# Altium project Demo.PrjPcb (part 2 of 2)

## Sheet Display_Memory.SchDoc
size A4; SheetNumber: 4; SheetTotal: 4
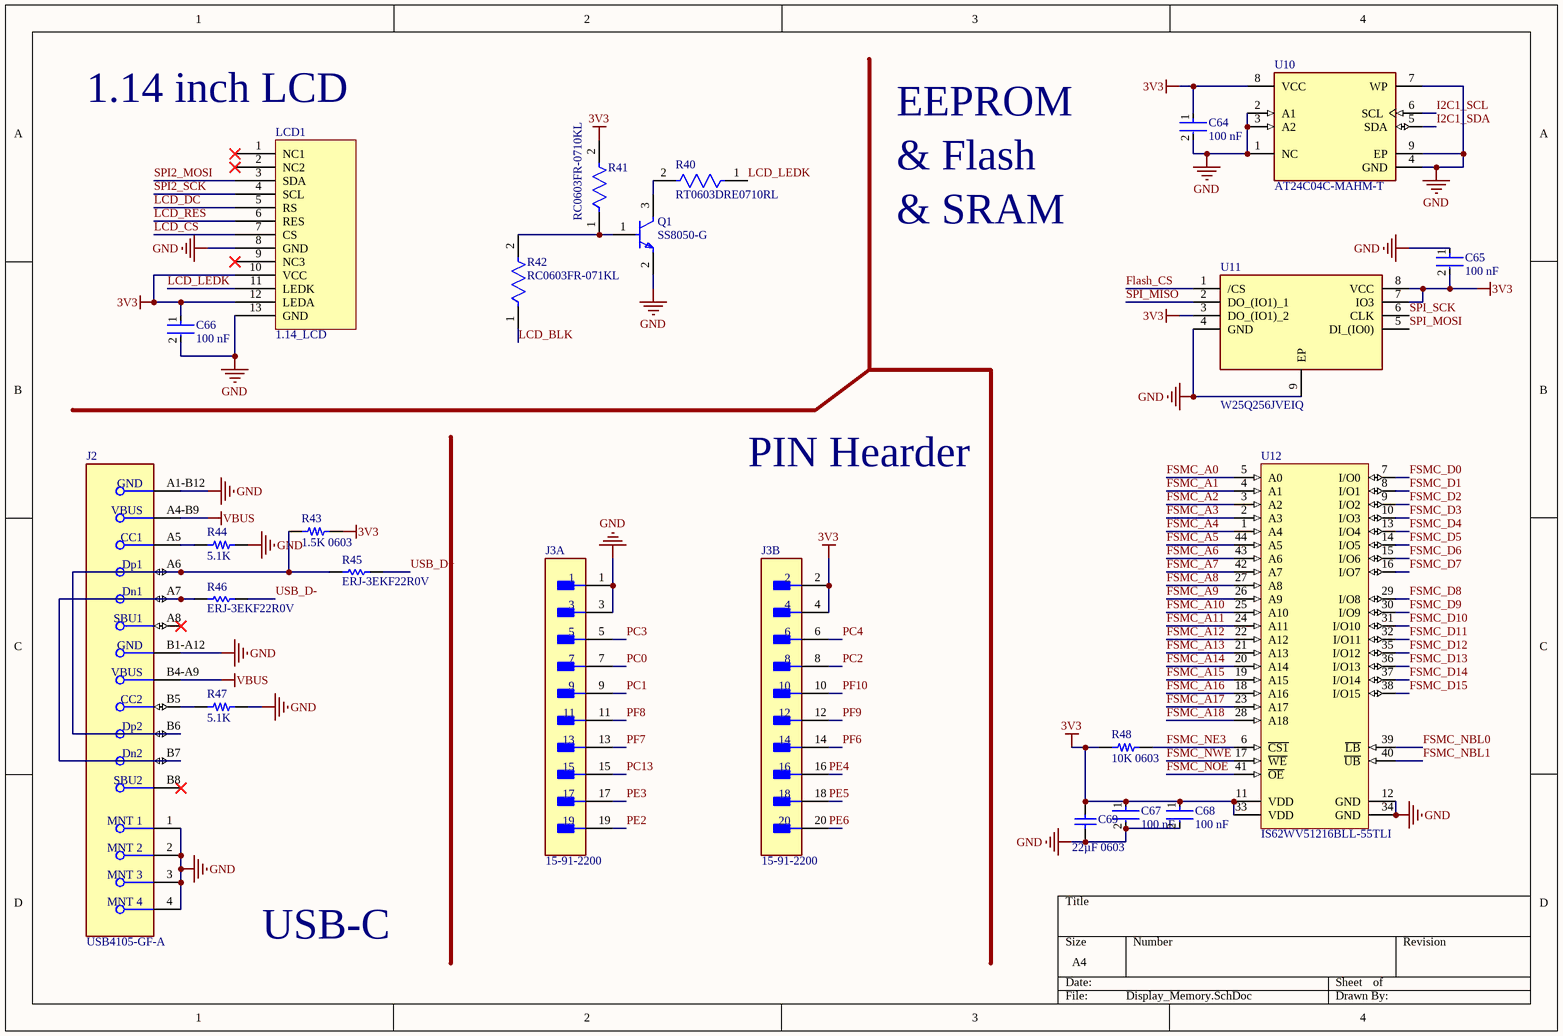
[diagram p3: Display_Memory.SchDoc]

### Parts
C64  100 nF  [FP-CL10-IPC_A]
C65  100 nF  [FP-CL10-IPC_A]
C66  100 nF  [FP-CL10-IPC_A]
C67  100 nF  [FP-CL10-IPC_A]
C68  100 nF  [FP-CL10-IPC_A]
C69  22µF 0603  [CAPC1608X100X20ML10]
J2  USB4105-GF-A  [FP-USB4105-GF-A-MFG]
J3  15-91-2200  [FP-15-91-2200-MFG]  (parts A,B of 2)
LCD1  1.14_LCD  [1.14_LCD]
Q1  SS8050-G  [FP-SS8050-G-MFG]
R40  RT0603DRE0710RL  [FP-RT0603-MFG]
R41  RC0603FR-0710KL  [FP-RC0603-0_55-IPC_C]
R42  RC0603FR-071KL  [FP-RC0603-0_55-IPC_C]
R43  1.5K 0603  [5.1K_0603]
R44  5.1K  [5.1K_0603]
R45  ERJ-3EKF22R0V  [RESC1608X55X30LL15T15]
R46  ERJ-3EKF22R0V  [RESC1608X55X30LL15T15]
R47  5.1K  [5.1K_0603]
R48  10K 0603  [5.1K_0603]
U10  AT24C04C-MAHM-T  [FP-C04-21355-Q4B-IPC_B]
U11  W25Q256JVEIQ  [W25Q256JVEIQ]
U12  IS62WV51216BLL-55TLI  [ISSI-TSOP-2-44_N]

### Nets
3V3: C64.1 C65.2 C66.1 C67.1 C68.1 C69.2 J3.2 J3.4 LCD1.10(VCC) LCD1.12(LEDA) R41.2 R43.2 R48.1 U10.8(VCC) U11.3(DO_(IO1)_2) U11.7(IO3) U11.8(VCC) U12.11(VDD) U12.33(VDD)
GND: C64.2 C65.1 C66.2 C67.2 C68.2 C69.1 J2.1(MNT_1) J2.2(MNT_2) J2.3(MNT_3) J2.4(MNT_4) J2.A1-B12(GND) J2.B1-A12(GND) J3.1 J3.3 LCD1.8(GND) LCD1.13(GND) Q1.2(E) R44.2 R47.2 U10.1(NC) U10.2(A1) U10.3(A2) U10.4(GND) U10.7(WP) U10.9(EP) U11.4(GND) U11.9(EP) U12.12(GND) U12.34(GND)
VBUS: J2.A4-B9(VBUS) J2.B4-A9(VBUS)
Flash_CS: U11.1(/CS)
FSMC_A0: U12.5(A0)
FSMC_A1: U12.4(A1)
FSMC_A2: U12.3(A2)
FSMC_A3: U12.2(A3)
FSMC_A4: U12.1(A4)
FSMC_A5: U12.44(A5)
FSMC_A6: U12.43(A6)
FSMC_A7: U12.42(A7)
FSMC_A8: U12.27(A8)
FSMC_A9: U12.26(A9)
FSMC_A10: U12.25(A10)
FSMC_A11: U12.24(A11)
FSMC_A12: U12.22(A12)
FSMC_A13: U12.21(A13)
FSMC_A14: U12.20(A14)
FSMC_A15: U12.19(A15)
FSMC_A16: U12.18(A16)
FSMC_A17: U12.23(A17)
FSMC_A18: U12.28(A18)
FSMC_D0: U12.7(I/O0)
FSMC_D1: U12.8(I/O1)
FSMC_D2: U12.9(I/O2)
FSMC_D3: U12.10(I/O3)
FSMC_D4: U12.13(I/O4)
FSMC_D5: U12.14(I/O5)
FSMC_D6: U12.15(I/O6)
FSMC_D7: U12.16(I/O7)
FSMC_D8: U12.29(I/O8)
FSMC_D9: U12.30(I/O9)
FSMC_D10: U12.31(I/O10)
FSMC_D11: U12.32(I/O11)
FSMC_D12: U12.35(I/O12)
FSMC_D13: U12.36(I/O13)
FSMC_D14: U12.37(I/O14)
FSMC_D15: U12.38(I/O15)
FSMC_NBL0: U12.39(~{LB})
FSMC_NBL1: U12.40(~{UB})
FSMC_NE3: R48.2 U12.6(~{CS1})
FSMC_NOE: U12.41(~{OE})
FSMC_NWE: U12.17(~{WE})
I2C1_SCL: U10.6(SCL)
I2C1_SDA: U10.5(SDA)
LCD_BLK: R42.1
LCD_CS: LCD1.7(CS)
LCD_DC: LCD1.5(RS)
LCD_LEDK: LCD1.11(LEDK) R40.1
LCD_RES: LCD1.6(RES)
PC0: J3.7
PC1: J3.9
PC2: J3.8
PC3: J3.5
PC4: J3.6
PC13: J3.15
PE2: J3.19
PE3: J3.17
PE4: J3.16
PE5: J3.18
PE6: J3.20
PF6: J3.14
PF7: J3.13
PF8: J3.11
PF9: J3.12
PF10: J3.10
SPI2_MOSI: LCD1.3(SDA)
SPI2_SCK: LCD1.4(SCL)
SPI_MISO: U11.2(DO_(IO1)_1)
SPI_MOSI: U11.5(DI_(IO0))
SPI_SCK: U11.6(CLK)
USB_D+: R45.2
USB_D-: R46.2
NetJ2_A5: J2.A5(CC1) R44.1
NetJ2_A6: J2.A6(Dp1) J2.B6(Dp2) R43.1 R45.1
NetJ2_A7: J2.A7(Dn1) J2.B7(Dn2) R46.1
NetJ2_B5: J2.B5(CC2) R47.1
NetQ1_1: Q1.1(B) R41.1 R42.2
NetQ1_3: Q1.3(C) R40.2

Not connected (* = marked no-connect by the designer): J2 A8(SBU1)* B8(SBU2)*; LCD1 1(NC1)* 2(NC2)* 9(NC3)*

### Notes on the sheet
- (near LCD1) 1.14 inch LCD
- EEPROM
- & Flash
- & SRAM
- PIN Hearder
- USB-C

### Library data of the parts
C64-C68 = CMP-13271-004036-1: Cap Ceramic 100nF 100V X7R ±10% Pad SMD 0603 +125°C T/R; Mount: Surface Mount; Packaging: Cut Tape; Width: 0.031inch; Thickness: 0.035inch; Length: 0.063inch; Tolerance: 10%; Min Operating Temperature: -55°C; Case/Package: 0603; Voltage Rating: 100V; Max Operating Temperature: 125°C; Case Code (Metric): 1608; Capacitance: 100nF; Case Code (Imperial): 0603
C69 = CMP-2000-05440-1: Chip Capacitor, 22 uF, +/- 20%, 6.3 V, -55 to 85 degC, 1608 (0603 Metric), RoHS, Tape and Reel; PCN Part Number: MLCCPartNumberChange30/Nov/2012; Manufacturer: TDK; Temperature Coefficient: X5R; Product Training Modules: CSeriesGeneralApplicationsSEAT,CCV,andTVCLDesignToolsGuidetoReplacinganElectrolyticCapacitorwithanMLCC; Other Names: 445-8028-1; Voltage - Rated: 6.3V; Design Resources: 20WNon-IsolatedBuckLEDDriverUsingPLLNK460KG; Online Catalog: CSeries,GeneralPurpose; Kits: 445-9003-KIT-ND-KITCAPCERHICAPMLCCSMD; Tolerance: ±20%; Series: C; Thickness (Max): 0.039"(1.00mm); Capacitance: 22µF; Mounting Type: SurfaceMount,MLCC; Ratings: -; Datasheet Version: Mar-15; Package Reference: 603; Packaging: CutTape(CT); Features: -; Package / Case: 0603(1608Metric); Family: CeramicCapacitors; Lead Spacing: -; RoHS Information: RoHSCertificate-MLCC; Manufacturer URL: http://www.tdk.com/; Lead Style: -; Category: Capacitors; Applications: GeneralPurpose; Package Description: 2-Pin Surface Mount Device, Body 1.6 x 0.8 mm; Standard Package: 1; Datasheet URL: http://www.farnell.com/datasheets/1913358.pdf; Height - Seated (Max): -; Operating Temperature: -55degC~85degC; Size / Dimension: 0.063"Lx0.031"W(1.60mmx0.80mm)
J2 = CMP-245163-000001-1: CONN RCPT USB2.0 TYPEC 5A; Manufacturer: GCT; Voltage Rating: 20V; Is Female: yes; Current Rating: 5/6.25/1.25/0.25A; Number Of Contacts: 16; Conn Orientation: Right Angle; Device Class L1: Connectors; Category: Conn; Lead Free: Yes; RoHS: TRUE; Temperature Range High: +85°C; Digikey Description: CONN RCPT USB2.0 TYPEC 5A; Device Class L3: unset; ComponentLink2Description: Datasheet; Manufacturer Part Number: USB4105-GF-A; Package: 0; Usb Standard: USB 2.0; Device Class L2: USB Connectors; Automotive: No; Temperature Range Low: -40°C; Height: 3.46mm; Temperature: -40°C to +85°C; Contact Material: Gold,Nickel; ComponentLink2URL: https://gct.co/files/drawings/usb4105.pdf; Octopart: https://octopart.com/usb4105-gf-a-gct-106627878
J3 = CMP-00257-00276808-1: 15-91-2200 Conn Unshrouded Header HDR 20 POS 2.54mm Solder ST Top Entry SMD C-Grid® Tube; NexarPartId: 276808; Number of Circuits: 20; Voltage Rating (DC): 250V; Max Voltage Rating (DC): 250.25kV; Glow Wire Compliant: Non-compliant; Gender: Male; Contact Resistance: 15mΩ; Current Rating: 3A; Contact Gender: Male; Min Operating Temperature: -40°C; Pitch: 2.54mm; Number of Rows: 1; Number of Positions: 20; Housing Color: Black; Max Voltage Rating (AC): 250V; Row Spacing: 2.54mm; Housing Material: Thermoplastic; Length: 25.4mm; Lead Pitch: 2.54mm; Halogen Free: Low Halogen; Material: Bronze; RoHS: Compliant; Contact Material: Bronze; Termination: Solder; Schedule B: 8536694040; Voltage Rating: 250V; Lead Free: Lead Free; Number of Contacts: 20; Depth: 5.08mm; Max Operating Temperature: 105°C; Color: Black; Mount: Surface Mount; ELV: Compliant; Orientation: Vertical, Right Angle; Radiation Hardening: No; Flammability Rating: UL94 V-0; Contact Plating: Tin
LCD1 = 1.14 LCD
Q1 = CMP-20235-000001-1: NPN TRANSISTOR 1.5A 40V SOT-23 R; Transition Frequency: 100MHz; Max Breakdown Voltage: 25V; Collector Emitter Voltage (VCEO): 400mV; Max Power Dissipation: 300mW; Max Collector Current: 1.5A; Case/Package: TO-236-3; Packaging: Tape and Reel; RoHS Compliant: Yes; Mount: Surface Mount; Collector Emitter Breakdown Voltage: 25V
R40 = CMP-2000-04609-2: RES SMD 10 OHM 0.5% 1/10W 0603; Manufacturer: Yageo; Voltage Rating: 75V; Tolerance: 0.005; Temperature Coefficient: 50 ppm/°C; Resistance: 10Ω; Power Rating: 0.1W; Value: 10Ω; Temperature Range Low: -55°C; RoHS: TRUE; Device Class L1: Passive Components; Footprint Url: http://www.yageo.com/exep/pages/download/literatures/PYu-R_Mount_10.pdf; Device Class L3: Chip SMD Resistors; Device Class L2: Resistors; Series: RT; ComponentLink2URL: http://www.yageo.com/documents/recent/PYu-RT_1-to-0.01_RoHS_L_9.pdf; Octopart: https://octopart.com/rt0603dre0710rl-yageo-1192091; Automotive: No; ComponentLink2Description: Datasheet; Ipc Land Pattern Name: RESC16080X45; Package: RT0603; Lead Free: Yes; Temperature: -55°C to +155°C; Category: Res; Height: 0.55mm; Temperature Range High: +155°C; Digikey Description: RES SMD 10 OHM 0.5% 1/10W 0603; Manufacturer Part Number: RT0603DRE0710RL; Composition: Thin Film
R41 = CMP-2100-03664-2: RES 10K OHM 1% 1/10W 0603; Voltage Rating: 75V; Voltage Rating (DC): 50V; Resistance: 10kR; Power Rating: 100mW; Temperature Coefficient: 100ppm/°C; Depth: 0.8mm; Termination: SMD/SMT; Resistor Type: Thick Film; Series: RC; Construction: Rectangular; Features: Moisture Resistant; Packaging: Tape and Reel; Min Operating Temperature: -55°C; Number of Terminations: 2; Lead Pitch: 0.3mm; RoHS Compliant: Yes; Case/Package: 0603; Resistance Tolerance: 1%; Military Standard: Not; Weight: 7.1E-05oz; Number of Pins: 2; Tolerance: 1%; Length: 1.6mm; Case Code (Imperial): 0603; Lead Free: Lead Free; Width: 0.8mm; Max Power Dissipation: 100mW; Height: 0.45mm; Max Operating Temperature: 155°C; Case Code (Metric): 1608; Size Code: 0603
R42 = CMP-1659-00009-5: RES 1K OHM 1% 1/10W 0603; Resistance: 1kR; Voltage Rating: 50V; Power Rating: 100mW; Temperature Coefficient: 100ppm/°C; Military Standard: Not; REACH SVHC: No SVHC; Size Code: 0603; Features: Moisture Resistant; Number of Terminations: 2; Technology: THICK FILM; Series: RC; Case Code (Metric): 1608; Resistance Tolerance: 1%; Resistor Type: Thick Film; Termination: SMD/SMT; Contact Plating: Tin; Radiation Hardening: No; Min Operating Temperature: -55°C; Max Operating Temperature: 155°C; Packaging: Tape and Reel; Max Power Dissipation: 100mW; RoHS Compliant: Yes; Height: 0.45mm; Lead Free: Lead Free; Case/Package: 0603; Length: 1.6mm; Tolerance: 1%; Case Code (Imperial): 0603; Construction: Rectangular; Depth: 0.8mm
R43 R44 R47 R48 = 5.1K_0603: SMT Resistor
R45 R46 = CMP-1012-00320-3: Chip Resistor, 22 Ohm, +/- 1%, 0.1 W, -55 to 155 degC, 0603 (1608 Metric), RoHS, Tape and Reel; PackageReference: 0603; ComponentLink2URL: http://industrial.panasonic.com/cdbs/www-data/pdf/RDA0000/AOA0000C86.pdf; ComponentLink2Description: Datasheet; PackageDescription: 2-Pin Surface Mount Device, Body 1.6 x 0.85 mm; ComponentLink1URL: http://www.panasonic.com/; ComponentLink1Description: Manufacturer URL; DatasheetVersion: Apr-15
U10 = CMP-06313-000185-1: IC EEPROM 4KBIT I2C 1MHZ 8UDFN; Write Protection: YES; Max Frequency: 400kHz; Access Time: 900ns; Supply Current: 3mA; Density: 4Kb; Min Supply Voltage: 1.7V; Organization: 512X8; Max Supply Voltage: 5.5V; Number of Pins: 8; Series: -; Memory Type: EEPROM; Radiation Hardening: No; RoHS Compliant: Yes; Packaging: Tape and Reel; Interface: I2C; Min Operating Temperature: -40°C; Contact Plating: Gold; Mount: Surface Mount; Package Quantity: 5000; Nominal Supply Current: 3mA; Access Time-Max: 900ns; Max Operating Temperature: 85°C; Frequency: 400kHz
U11 = W25Q256JVEIQ: 256M-bit Serial Flash Memory with uniform 4KB sectors and Dual/Quad SPI; Manufacturer_Name: Winbond; Geometry.Height: 0.8mm; Manufacturer_Part_Number: W25Q256JVEIQ; Mouser Part Number: 454-W25Q256JVEIQ; Mouser Price/Stock: https://www.mouser.co.uk/ProductDetail/Winbond/W25Q256JVEIQ?qs=qSfuJ%252Bfl%2Fd4o%2FNFUf7yCgA%3D%3D; Arrow Part Number: W25Q256JVEIQ; Arrow Price/Stock: https://www.arrow.com/en/products/w25q256jveiq/winbond-electronics?region=nac; Datasheet Link: https://www.winbond.com/hq/search-resource-file.jsp?partNo=W25Q256JVEIQ&type=datasheet
U12 = CMP-0515-00183-1: 8 M Low Voltage, Ultra Low Power CMOS SRAM, 512 K x 16, -40 to 85 degC, 44-Pin SOP (TSOP-2-44), Pb-Free; Manufacturer: Integrated Silicon Solution Inc (ISSI); Density: 8M; Packing: Tray / Tube; Speed (ns): 55; ComponentLink3URL: http://www.issi.com/WW/pdf/61-64WV6416EEBLL.pdf; ComponentLink3Description: Package Specification; PackageVersion: Rev. F, 06/2008; ComponentLink2Description: Datasheet; ComponentLink2URL: http://www.issi.com/WW/pdf/62WV51216ALL.pdf; Mounting Technology: Surface Mount; ComponentLink1URL: http://www.issi.com/US/index.shtml; DatasheetVersion: Rev. D; PartNumber: IS62WV51216BLL-55TLI; PackageDescription: 44-Pin 400 mil TSOP-2, Body 18.41 x 10.16 mm, Pitch 0.8 mm; Organization: 512K x 16; RoHS: Pb-Free; ComponentLink1Description: Manufacturer URL; PackageReference: TSOP-2-44

## Nets that join several sheets
3V3: MCU (37 pins), Sensors (22 pins), Port (25 pins), Display_Memory (19 pins)
GND: MCU (52 pins), Sensors (33 pins), Port (41 pins), Display_Memory (29 pins)
VBUS: MCU (C24.1 C25.1 R19.2 U8.5), Sensors (C13.2 C14.2 R7.1 U6.1), Display_Memory (J2.A4-B9 J2.B4-A9)
BW16_EN: MCU (U7.J3), Port (U9.3)
Flash_CS: MCU (U7.K2), Display_Memory (U11.1)
FSMC_A0: MCU (U7.C3), Display_Memory (U12.5)
FSMC_A1: MCU (U7.C4), Display_Memory (U12.4)
FSMC_A2: MCU (U7.D4), Display_Memory (U12.3)
FSMC_A3: MCU (U7.E2), Display_Memory (U12.2)
FSMC_A4: MCU (U7.E3), Display_Memory (U12.1)
FSMC_A5: MCU (U7.E4), Display_Memory (U12.44)
FSMC_A6: MCU (U7.L5), Display_Memory (U12.43)
FSMC_A7: MCU (U7.K5), Display_Memory (U12.42)
FSMC_A8: MCU (U7.M6), Display_Memory (U12.27)
FSMC_A9: MCU (U7.L6), Display_Memory (U12.26)
FSMC_A10: MCU (U7.K6), Display_Memory (U12.25)
FSMC_A11: MCU (U7.J6), Display_Memory (U12.24)
FSMC_A12: MCU (U7.J12), Display_Memory (U12.22)
FSMC_A13: MCU (U7.J11), Display_Memory (U12.21)
FSMC_A14: MCU (U7.J10), Display_Memory (U12.20)
FSMC_A15: MCU (U7.H12), Display_Memory (U12.19)
FSMC_A16: MCU (U7.H9), Display_Memory (U12.18)
FSMC_A17: MCU (U7.L10), Display_Memory (U12.23)
FSMC_A18: MCU (U7.K10), Display_Memory (U12.28)
FSMC_D0: MCU (U7.K11), Display_Memory (U12.7)
FSMC_D1: MCU (U7.K12), Display_Memory (U12.8)
FSMC_D2: MCU (U7.E10), Display_Memory (U12.9)
FSMC_D3: MCU (U7.D10), Display_Memory (U12.10)
FSMC_D4: MCU (U7.M7), Display_Memory (U12.13)
FSMC_D5: MCU (U7.L7), Display_Memory (U12.14)
FSMC_D6: MCU (U7.K7), Display_Memory (U12.15)
FSMC_D7: MCU (U7.J7), Display_Memory (U12.16)
FSMC_D8: MCU (U7.H8), Display_Memory (U12.29)
FSMC_D9: MCU (U7.J8), Display_Memory (U12.30)
FSMC_D10: MCU (U7.K8), Display_Memory (U12.31)
FSMC_D11: MCU (U7.L8), Display_Memory (U12.32)
FSMC_D12: MCU (U7.M8), Display_Memory (U12.35)
FSMC_D13: MCU (U7.L9), Display_Memory (U12.36)
FSMC_D14: MCU (U7.K9), Display_Memory (U12.37)
FSMC_D15: MCU (U7.J9), Display_Memory (U12.38)
FSMC_NBL0: MCU (U7.A5), Display_Memory (U12.39)
FSMC_NBL1: MCU (U7.A4), Display_Memory (U12.40)
FSMC_NE3: MCU (U7.D8), Display_Memory (R48.2 U12.6)
FSMC_NOE: MCU (U7.C9), Display_Memory (U12.41)
FSMC_NWE: MCU (U7.B9), Display_Memory (U12.17)
I2C1_SCL: MCU (U7.C5), Sensors (6 pins), Display_Memory (U10.6)
I2C1_SDA: MCU (U7.B5), Sensors (6 pins), Display_Memory (U10.5)
LCD_BLK: MCU (U7.L11), Display_Memory (R42.1)
LCD_CS: MCU (U7.M9), Display_Memory (LCD1.7)
LCD_DC: MCU (U7.M10), Display_Memory (LCD1.5)
LCD_RES: MCU (U7.M11), Display_Memory (LCD1.6)
LIS2_INT1: MCU (U7.B6), Sensors (U4.12)
LIS2_INT2: MCU (U7.C6), Sensors (U4.11)
NRST: MCU (R17.1 U7.F1), Port (CN1.12)
PC0: MCU (U7.H1), Display_Memory (J3.7)
PC1: MCU (U7.H2), Display_Memory (J3.9)
PC2: MCU (U7.H3), Display_Memory (J3.8)
PC3: MCU (U7.H4), Display_Memory (J3.5)
PC4: MCU (U7.J4), Display_Memory (J3.6)
PC13: MCU (U7.A1), Display_Memory (J3.15)
PE2: MCU (U7.A3), Display_Memory (J3.19)
PE3: MCU (U7.A2), Display_Memory (J3.17)
PE4: MCU (U7.B2), Display_Memory (J3.16)
PE5: MCU (U7.B3), Display_Memory (J3.18)
PE6: MCU (U7.B4), Display_Memory (J3.20)
PF6: MCU (U7.F3), Display_Memory (J3.14)
PF7: MCU (U7.F2), Display_Memory (J3.13)
PF8: MCU (U7.G3), Display_Memory (J3.11)
PF9: MCU (U7.G2), Display_Memory (J3.12)
PF10: MCU (U7.G1), Display_Memory (J3.10)
RX1: MCU (U7.D11), Port (CN1.13)
SD_DETE: MCU (U7.E12), Port (D3.1 TF1.G4)
SDIO_CK: MCU (U7.C10), Port (TF1.5)
SDIO_CMD: MCU (U7.E9), Port (R36.1 TF1.3)
SDIO_D0: MCU (U7.F11), Port (R38.2 TF1.7)
SDIO_D1: MCU (U7.E11), Port (R39.2 TF1.8)
SDIO_D2: MCU (U7.B11), Port (R34.2 TF1.1)
SDIO_D3: MCU (U7.B10), Port (R35.2 TF1.2)
SPI2_MOSI: MCU (U7.L12), Display_Memory (LCD1.3)
SPI2_SCK: MCU (U7.M12), Display_Memory (LCD1.4)
SPI_MISO: MCU (U7.L3), Port (B1.34), Display_Memory (U11.2)
SPI_MOSI: MCU (U7.M3), Port (B1.35), Display_Memory (U11.5)
SPI_SCK: MCU (U7.K3), Port (B1.33), Display_Memory (U11.6)
SWCLK: MCU (U7.A11), Port (CN1.6)
SWDIO: MCU (U7.A12), Port (CN1.4)
SWO: MCU (U7.A7), Port (CN1.8)
TX1: MCU (U7.D12), Port (CN1.14)
UART2_RX: MCU (U7.M2), Port (R32.2 U9.16)
UART2_TX: MCU (U7.L2), Port (R33.2 U9.15)
USB_D+: MCU (U7.B12), Display_Memory (R45.2)
USB_D-: MCU (U7.C12), Display_Memory (R46.2)
W5500_CS: MCU (U7.L4), Port (B1.32)
W5500_INT: MCU (U7.K4), Port (B1.36)
W5500_RST: MCU (U7.M4), Port (B1.37)